# EAGLE design button_breakout_v1.1 (EAGLE 9.6.2)
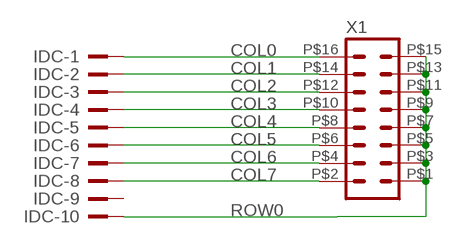
[diagram p0: schematic, sheet 1]

## Parts
IDC  CONN-IDC-10PSMD  [CONN-IDC10P-SMD]
X1  MA08-2JSMD  [MA08-2-SMDJ]

## Nets
COL0: IDC.P$1 X1.P$16
COL1: IDC.P$2 X1.P$14
COL2: IDC.P$3 X1.P$12
COL3: IDC.P$4 X1.P$10
COL4: IDC.P$5 X1.P$8
COL5: IDC.P$6 X1.P$6
COL6: IDC.P$7 X1.P$4
COL7: IDC.P$8 X1.P$2
ROW0: IDC.P$10 X1.P$1 X1.P$3 X1.P$5 X1.P$7 X1.P$9 X1.P$11 X1.P$13 X1.P$15
Unconnected: IDC.P$9

## Library data of the parts
IDC = joakim:CONN-IDC-10P: 10P IDC Header
X1 = joakim:MA08-2J: PIN HEADER

## Board
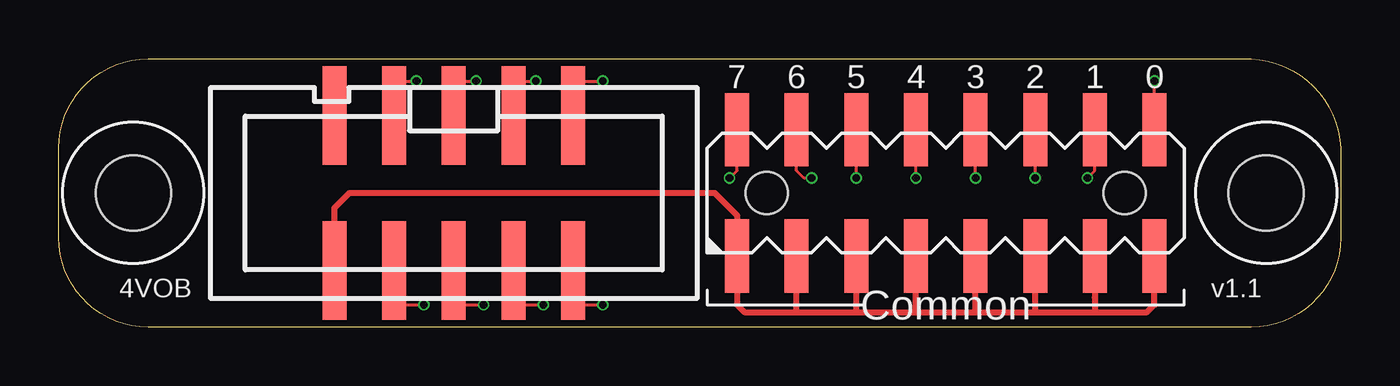
[diagram p1: board, top side]
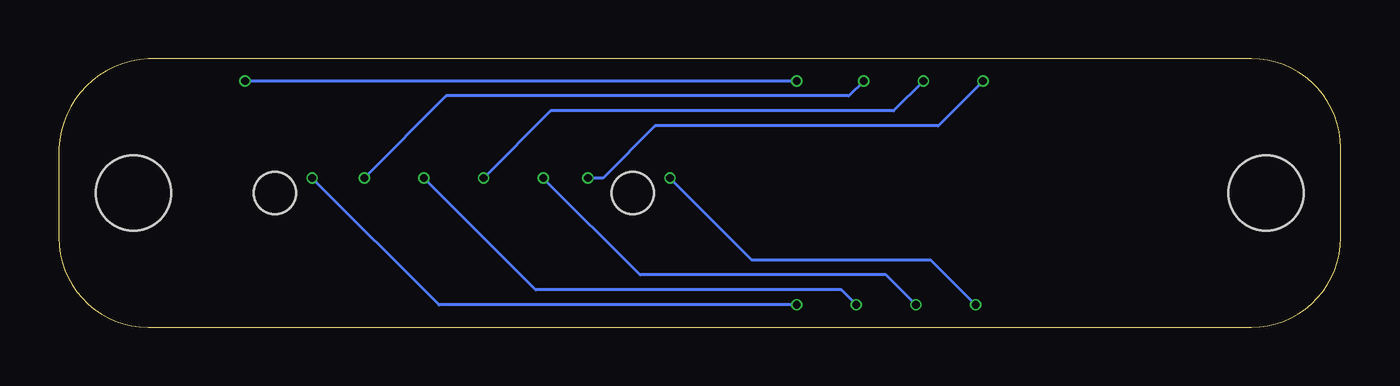
[diagram p2: board, bottom side, seen from below]

Size 54.61 x 11.43 mm. Coordinates in mm from the lower left corner, seen from the top.
Outline: 0,7.62 arc-90 3.81,11.43 50.8,11.43 arc-85 54.61,7.62 54.61,3.81 arc-90 50.8,0 3.81,0 arc-90 0,3.81 0,7.62
Copper layers (1*16): Top 0.035mm / dielectric 1.6mm / Bottom 0.035mm
Design rules "jlcpcb-2layers": minimum track width 5mil, minimum drill 0.3mm, track to track 5mil, track to pad 5mil, pad to pad 5mil, via to via 5mil, smd to smd 5mil, copper to edge 0.2mm, drill to drill 6mil, minimum pad ring 10mil, minimum via ring 3mil, stop-mask expansion 4mil, vias tented up to drill 0mil, thermal gap 10mil
Holes 3.2 mm at 3.17,5.71 51.44,5.71

### Footprints (pad centres in the part's own frame; a part is rotated, then mirrored left to right if it is on the bottom)
CONN-IDC10P-SMD = smd 1.02 x 4.2: P$1 -5.08,-3.3; P$2 -5.08,3.3; P$3 -2.54,-3.3; P$4 -2.54,3.3; P$5 0,-3.3; P$6 0,3.3; P$7 2.54,-3.3; P$8 2.54,3.3; P$9 5.08,-3.3; P$10 5.08,3.3
MA08-2-SMDJ = smd 1.02 x 3.12: P$1 -8.89,-2.69; P$2 -8.89,2.69; P$3 -6.35,-2.69; P$4 -6.35,2.69; P$5 -3.81,-2.69; P$6 -3.81,2.69; P$7 -1.27,-2.69; P$8 -1.27,2.69; P$9 1.27,-2.69; P$10 1.27,2.69; P$11 3.81,-2.69; P$12 3.81,2.69; P$13 6.35,-2.69; P$14 6.35,2.69; P$15 8.89,-2.69; P$16 8.89,2.69 | hole 1.8: -7.62,0; 7.62,0

### Placement (x,y rotation side)
IDC  16.83,5.71 180 top
X1  37.78,5.71 0 top

### Tracks (layer width: path | path; a pad name or v marks a point on that pad's centre or on a via)
COL0  (via drill 0.33)
  Top 0.127: IDC.P$1 21.91,10.48 v23.18,10.48 | X1.P$16 v46.67,10.48
  Bottom 0.127: v23.18,10.48 v46.67,10.48
COL1  (via drill 0.33)
  Top 0.127: IDC.P$2 22.22,2.1 22.22,0.95 v23.18,0.95 | v43.82,6.35 44.13,6.67 X1.P$14
  Bottom 0.127: v23.18,0.95 38.42,0.95 v43.82,6.35
COL2  (via drill 0.33)
  Top 0.127: IDC.P$3 19.37,10.48 v20.32,10.48 | v41.59,6.35 X1.P$12
  Bottom 0.127: v20.32,10.48 20.95,9.84 38.1,9.84 v41.59,6.35
COL3  (via drill 0.33)
  Top 0.127: IDC.P$4 19.37,0.95 v20.64,0.95 | v39.05,6.35 X1.P$10
  Bottom 0.127: v20.64,0.95 21.27,1.59 34.29,1.59 v39.05,6.35
COL4  (via drill 0.33)
  Top 0.127: IDC.P$5 16.83,10.48 v17.78,10.48 | v36.51,6.35 X1.P$8
  Bottom 0.127: v17.78,10.48 19.05,9.21 33.65,9.21 v36.51,6.35
COL5  (via drill 0.33)
  Top 0.127: IDC.P$6 16.83,0.95 v18.1,0.95 | v33.97,6.35 X1.P$6
  Bottom 0.127: v18.1,0.95 19.37,2.22 29.84,2.22 v33.97,6.35
COL6  (via drill 0.33)
  Top 0.127: IDC.P$7 14.29,10.48 v15.24,10.48 | v32.07,6.35 31.75,6.35 31.43,6.67 X1.P$4
  Bottom 0.127: v15.24,10.48 17.15,8.57 29.21,8.57 31.43,6.35 v32.07,6.35
COL7  (via drill 0.33)
  Top 0.127: IDC.P$8 14.29,0.95 v15.56,0.95 | v28.58,6.35 28.89,6.67 X1.P$2
  Bottom 0.127: v15.56,0.95 17.46,2.86 25.08,2.86 v28.58,6.35
ROW0
  Top 0.127: X1.P$1 28.89,4.45
  Top 0.254: IDC.P$10 11.75,5.08 12.38,5.71 27.94,5.71 28.89,4.76 28.89,4.45 28.89,0.95 29.21,0.64 31.43,0.64 | 31.43,0.64 33.97,0.64 | 33.97,0.64 36.51,0.64 | 36.51,0.64 39.05,0.64 | 39.05,0.64 41.59,0.64 | 41.59,0.64 44.13,0.64 | 44.13,0.64 46.36,0.64 46.67,0.95 X1.P$15 | 44.13,0.64 44.13,1.27 44.13,2.54 X1.P$13 | 41.59,0.64 X1.P$11 | 39.05,0.64 X1.P$9 | 36.51,0.64 X1.P$7 | 33.97,0.64 X1.P$5 | 31.43,0.64 X1.P$3

### Text on the board
tNames: 7 | 6 | 5 | 4 | 3 | 2 | 1 | 0 | 4VOB | v1.1 | Common